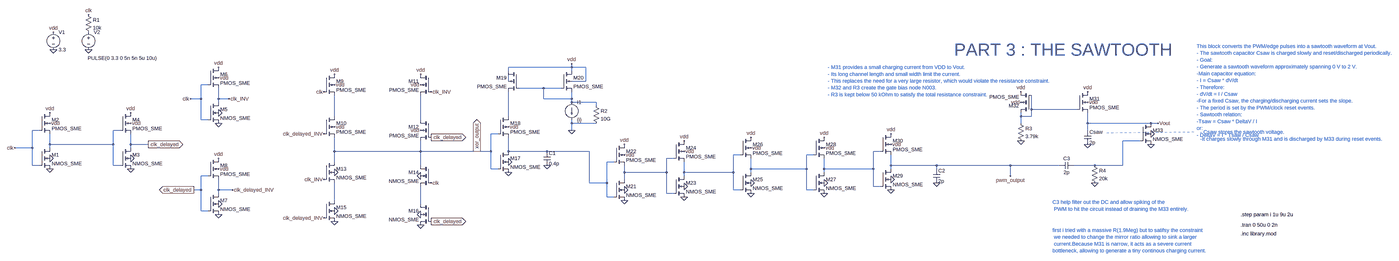
[diagram p0: schematic CMOS_Project_part3.asc, whole sheet]
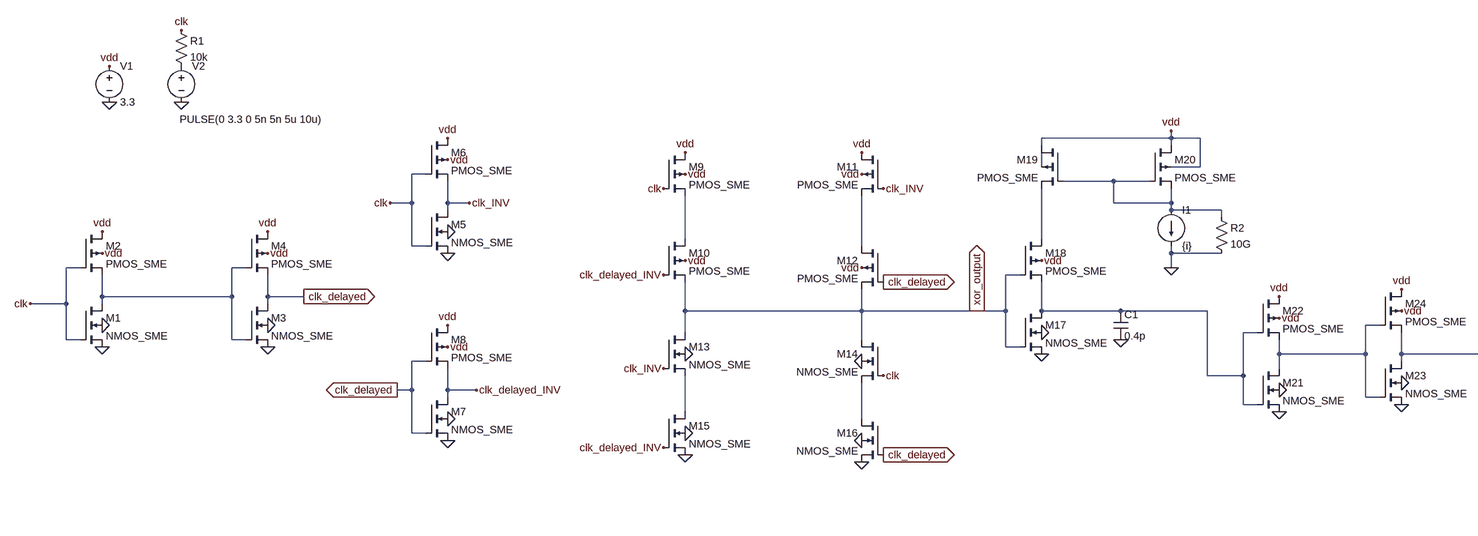
[diagram p1: schematic CMOS_Project_part3.asc, part, row 1 of 1, column 1 of 2]
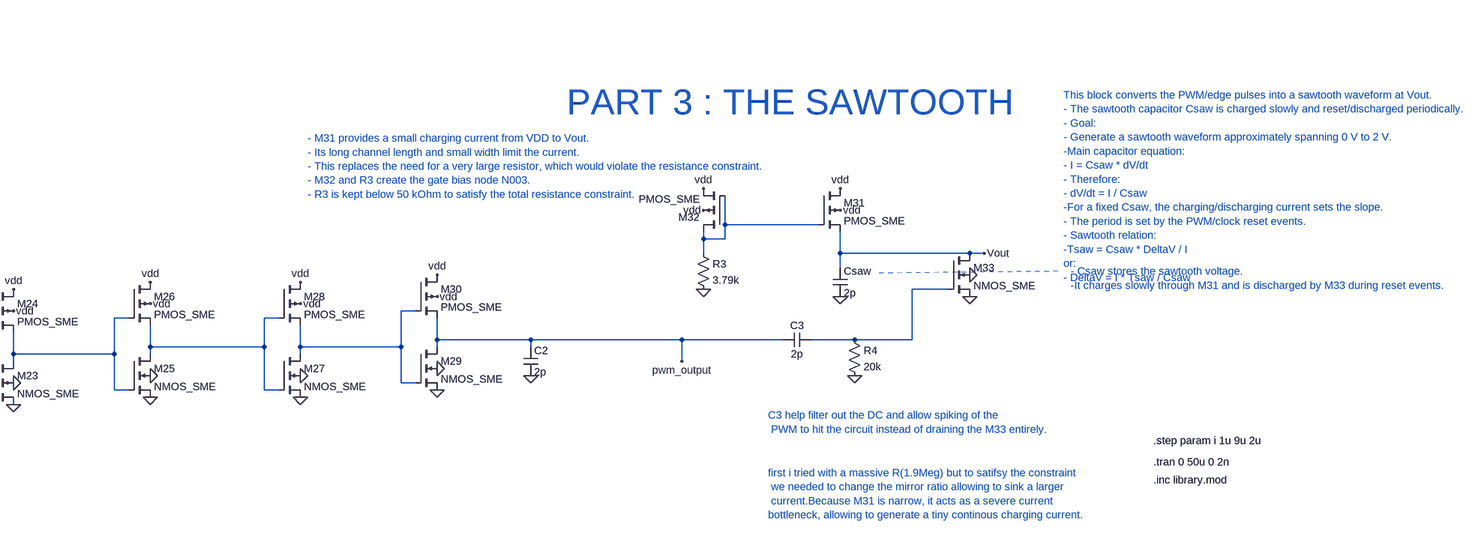
[diagram p2: schematic CMOS_Project_part3.asc, part, row 1 of 1, column 2 of 2]
CMOS_Project_part3.asc, the LTspice schematic file:
Version 4
SHEET 1 7728 1124
WIRE 2688 -128 2688 -144
WIRE 2688 -128 2400 -128
WIRE 2752 -128 2688 -128
WIRE 2400 -112 2400 -128
WIRE 2688 -112 2688 -128
WIRE 2400 -64 2400 -96
WIRE 2752 -64 2752 -128
WIRE 2752 -64 2688 -64
WIRE 960 -48 928 -48
WIRE 2560 -32 2448 -32
WIRE 2640 -32 2560 -32
WIRE 928 16 928 -48
WIRE 928 16 880 16
WIRE 1008 16 1008 -32
WIRE 1056 16 1008 16
WIRE 2560 16 2560 -32
WIRE 2688 16 2688 -16
WIRE 2688 16 2560 16
WIRE 1008 32 1008 16
WIRE 2688 32 2688 16
WIRE 2800 32 2688 32
WIRE 2800 48 2800 32
WIRE 4800 64 4800 0
WIRE 5008 64 4800 64
WIRE 1536 96 1536 0
WIRE 2400 96 2400 -16
WIRE 4752 96 4752 80
WIRE 4800 96 4800 64
WIRE 4800 96 4752 96
WIRE 928 112 928 16
WIRE 960 112 928 112
WIRE 2000 112 2000 0
WIRE 2688 128 2688 112
WIRE 2800 128 2688 128
WIRE 4752 128 4752 96
WIRE 5056 128 5056 80
WIRE 5344 128 5056 128
WIRE 5376 128 5344 128
WIRE 192 160 160 160
WIRE 560 160 528 160
WIRE 2688 160 2688 128
WIRE 5056 160 5056 128
WIRE 2352 176 2320 176
WIRE 5296 208 5216 208
WIRE 240 224 240 176
WIRE 528 224 528 160
WIRE 528 224 240 224
WIRE 608 224 608 176
WIRE 688 224 608 224
WIRE 160 240 160 160
WIRE 160 240 80 240
WIRE 240 240 240 224
WIRE 608 240 608 224
WIRE 1536 256 1536 192
WIRE 2000 256 2000 208
WIRE 2000 256 1536 256
WIRE 2256 256 2000 256
WIRE 2320 256 2320 176
WIRE 2320 256 2256 256
WIRE 2400 256 2400 192
WIRE 2576 256 2400 256
WIRE 2768 256 2576 256
WIRE 4112 256 4080 256
WIRE 3456 272 3424 272
WIRE 3808 272 3776 272
WIRE 3152 288 3120 288
WIRE 1536 304 1536 256
WIRE 2880 304 2848 304
WIRE 160 320 160 240
WIRE 192 320 160 320
WIRE 528 320 528 224
WIRE 560 320 528 320
WIRE 2000 320 2000 256
WIRE 4160 320 4160 272
WIRE 4368 320 4160 320
WIRE 4704 320 4368 320
WIRE 4928 320 4704 320
WIRE 5088 320 4992 320
WIRE 5216 320 5216 208
WIRE 5216 320 5088 320
WIRE 2320 336 2320 256
WIRE 2352 336 2320 336
WIRE 3504 336 3504 288
WIRE 3776 336 3776 272
WIRE 3776 336 3504 336
WIRE 3856 336 3856 288
WIRE 4080 336 4080 256
WIRE 4080 336 3856 336
WIRE 4160 336 4160 320
WIRE 4368 336 4368 320
WIRE 2928 352 2928 320
WIRE 3120 352 3120 288
WIRE 3120 352 2928 352
WIRE 3200 352 3200 304
WIRE 3424 352 3424 272
WIRE 3424 352 3200 352
WIRE 3504 352 3504 336
WIRE 3856 352 3856 336
WIRE 960 368 928 368
WIRE 3200 368 3200 352
WIRE 4704 368 4704 320
WIRE 2928 384 2928 352
WIRE 2768 400 2768 256
WIRE 2848 400 2848 304
WIRE 2848 400 2768 400
WIRE 4080 416 4080 336
WIRE 4112 416 4080 416
WIRE 928 432 928 368
WIRE 928 432 896 432
WIRE 1008 432 1008 384
WIRE 1072 432 1008 432
WIRE 3424 432 3424 352
WIRE 3456 432 3424 432
WIRE 3776 432 3776 336
WIRE 3808 432 3776 432
WIRE 1008 448 1008 432
WIRE 3120 448 3120 352
WIRE 3152 448 3120 448
WIRE 2848 464 2848 400
WIRE 2880 464 2848 464
WIRE 1536 480 1536 400
WIRE 2000 496 2000 416
WIRE 928 528 928 432
WIRE 960 528 928 528
FLAG 416 -208 0
FLAG 240 288 0
FLAG 256 -208 0
FLAG 256 -288 vdd
FLAG 240 128 vdd
FLAG 608 336 0
FLAG 608 288 0
FLAG 608 80 vdd
FLAG 608 128 vdd
FLAG 240 336 0
FLAG 240 80 vdd
FLAG 1008 128 0
FLAG 1008 80 0
FLAG 1008 -128 vdd
FLAG 1008 -80 vdd
FLAG 1008 544 0
FLAG 1008 496 0
FLAG 1008 288 vdd
FLAG 1008 336 vdd
FLAG 1536 -96 vdd
FLAG 1536 -48 vdd
FLAG 1536 144 vdd
FLAG 2000 -96 vdd
FLAG 2000 -48 vdd
FLAG 2000 160 vdd
FLAG 1536 352 0
FLAG 2000 368 0
FLAG 1536 576 0
FLAG 1536 528 0
FLAG 2000 592 0
FLAG 2000 544 0
FLAG 2400 352 0
FLAG 2400 304 0
FLAG 2400 144 vdd
FLAG 2576 320 0
FLAG 2688 160 0
FLAG 2688 -144 vdd
FLAG 2928 480 0
FLAG 2928 432 0
FLAG 2928 224 vdd
FLAG 2928 272 vdd
FLAG 3200 464 0
FLAG 3200 416 0
FLAG 3200 208 vdd
FLAG 3200 256 vdd
FLAG 3504 448 0
FLAG 3504 400 0
FLAG 3504 192 vdd
FLAG 3504 240 vdd
FLAG 4368 400 0
FLAG 3856 448 0
FLAG 3856 400 0
FLAG 3856 192 vdd
FLAG 3856 240 vdd
FLAG 4160 432 0
FLAG 4160 384 0
FLAG 4160 176 vdd
FLAG 4160 224 vdd
FLAG 688 224 clk_delayed
IOPIN 688 224 Out
FLAG 416 -368 clk
FLAG 80 240 clk
FLAG 1072 432 clk_delayed_INV
FLAG 880 16 clk
FLAG 1056 16 clk_INV
FLAG 896 432 clk_delayed
IOPIN 896 432 Out
FLAG 1488 -16 clk
FLAG 2048 400 clk
FLAG 2048 -16 clk_INV
FLAG 1488 176 clk_delayed_INV
FLAG 1488 384 clk_INV
FLAG 1488 560 clk_delayed_INV
FLAG 2048 576 clk_delayed
IOPIN 2048 576 Out
FLAG 2048 192 clk_delayed
IOPIN 2048 192 Out
FLAG 2256 256 xor_output
IOPIN 2256 256 Out
FLAG 5056 -16 vdd
FLAG 5056 32 vdd
FLAG 4752 32 vdd
FLAG 4752 -16 vdd
FLAG 5344 224 0
FLAG 5344 176 0
FLAG 4752 208 0
FLAG 5376 128 Vout
FLAG 5056 224 0
FLAG 5088 400 0
FLAG 4704 368 pwm_output
SYMBOL nmos4 192 240 R0
SYMATTR InstName M1
SYMATTR Value NMOS_SME
SYMATTR Value2 l=3u w=0.4u
SYMBOL pmos4 192 80 R0
SYMATTR InstName M2
SYMATTR Value PMOS_SME
SYMATTR Value2 l=3u w=0.4u
SYMBOL voltage 256 -304 R0
WINDOW 123 0 0 Left 0
WINDOW 39 0 0 Left 0
SYMATTR InstName V1
SYMATTR Value 3.3
SYMBOL voltage 416 -304 R0
WINDOW 123 0 0 Left 0
WINDOW 39 0 0 Left 0
WINDOW 3 -4 134 Left 2
SYMATTR Value PULSE(0 3.3 0 5n 5n 5u 10u)
SYMATTR InstName V2
SYMBOL nmos4 560 240 R0
SYMATTR InstName M3
SYMATTR Value NMOS_SME
SYMATTR Value2 l=3u w=0.4u
SYMBOL pmos4 560 80 R0
SYMATTR InstName M4
SYMATTR Value PMOS_SME
SYMATTR Value2 l=3u w=0.4u
SYMBOL nmos4 960 32 R0
SYMATTR InstName M5
SYMATTR Value NMOS_SME
SYMATTR Value2 l=0.35u w=0.4u
SYMBOL pmos4 960 -128 R0
SYMATTR InstName M6
SYMATTR Value PMOS_SME
SYMATTR Value2 l=0.35u w=0.4u
SYMBOL nmos4 960 448 R0
SYMATTR InstName M7
SYMATTR Value NMOS_SME
SYMATTR Value2 l=0.35u w=0.4u
SYMBOL pmos4 960 288 R0
SYMATTR InstName M8
SYMATTR Value PMOS_SME
SYMATTR Value2 l=0.35u w=0.4u
SYMBOL pmos4 1488 -96 R0
SYMATTR InstName M9
SYMATTR Value PMOS_SME
SYMATTR Value2 l=0.35u w=0.4u
SYMBOL pmos4 1488 96 R0
SYMATTR InstName M10
SYMATTR Value PMOS_SME
SYMATTR Value2 l=0.35u w=0.4u
SYMBOL pmos4 2048 -96 M0
SYMATTR InstName M11
SYMATTR Value PMOS_SME
SYMATTR Value2 l=0.35u w=0.4u
SYMBOL pmos4 2048 112 M0
SYMATTR InstName M12
SYMATTR Value PMOS_SME
SYMATTR Value2 l=0.35u w=0.4u
SYMBOL nmos4 1488 304 R0
SYMATTR InstName M13
SYMATTR Value NMOS_SME
SYMATTR Value2 l=0.35u w=0.4u
SYMBOL nmos4 2048 320 M0
SYMATTR InstName M14
SYMATTR Value NMOS_SME
SYMATTR Value2 l=0.35u w=0.4u
SYMBOL nmos4 1488 480 R0
SYMATTR InstName M15
SYMATTR Value NMOS_SME
SYMATTR Value2 l=0.35u w=0.4u
SYMBOL nmos4 2048 496 M0
SYMATTR InstName M16
SYMATTR Value NMOS_SME
SYMATTR Value2 l=0.35u w=0.4u
SYMBOL nmos4 2352 256 R0
SYMATTR InstName M17
SYMATTR Value NMOS_SME
SYMATTR Value2 l=0.35u w=4u
SYMBOL pmos4 2352 96 R0
SYMATTR InstName M18
SYMATTR Value PMOS_SME
SYMATTR Value2 l=0.35u w=0.4u
SYMBOL cap 2560 256 R0
SYMATTR InstName C1
SYMATTR Value 0.4p
SYMBOL pmos4 2448 -112 M0
SYMATTR InstName M19
SYMATTR Value PMOS_SME
SYMATTR Value2 l=0.35u w=0.4u
SYMBOL pmos4 2640 -112 R0
SYMATTR InstName M20
SYMATTR Value PMOS_SME
SYMATTR Value2 l=0.35u w=2u
SYMBOL current 2688 32 R0
WINDOW 123 0 0 Left 0
WINDOW 39 0 0 Left 0
SYMATTR InstName I1
SYMATTR Value {i}
SYMBOL res 2784 32 R0
SYMATTR InstName R2
SYMATTR Value 10G
SYMBOL nmos4 2880 384 R0
SYMATTR InstName M21
SYMATTR Value NMOS_SME
SYMATTR Value2 l=0.35u w=4u
SYMBOL pmos4 2880 224 R0
SYMATTR InstName M22
SYMATTR Value PMOS_SME
SYMATTR Value2 l=0.35u w=3.5u
SYMBOL nmos4 3152 368 R0
SYMATTR InstName M23
SYMATTR Value NMOS_SME
SYMATTR Value2 l=0.35u w=2u
SYMBOL pmos4 3152 208 R0
SYMATTR InstName M24
SYMATTR Value PMOS_SME
SYMATTR Value2 l=0.35u w=2u
SYMBOL nmos4 3456 352 R0
SYMATTR InstName M25
SYMATTR Value NMOS_SME
SYMATTR Value2 l=0.35u w=4u
SYMBOL pmos4 3456 192 R0
SYMATTR InstName M26
SYMATTR Value PMOS_SME
SYMATTR Value2 l=0.35u w=4u
SYMBOL cap 4352 336 R0
SYMATTR InstName C2
SYMATTR Value 2p
SYMBOL nmos4 3808 352 R0
SYMATTR InstName M27
SYMATTR Value NMOS_SME
SYMATTR Value2 l=0.35u w=5u
SYMBOL pmos4 3808 192 R0
SYMATTR InstName M28
SYMATTR Value PMOS_SME
SYMATTR Value2 l=0.35u w=5u
SYMBOL nmos4 4112 336 R0
SYMATTR InstName M29
SYMATTR Value NMOS_SME
SYMATTR Value2 l=0.35u w=6u
SYMBOL pmos4 4112 176 R0
SYMATTR InstName M30
SYMATTR Value PMOS_SME
SYMATTR Value2 l=0.35u w=6u
SYMBOL Res 400 -384 R0
SYMATTR InstName R1
SYMATTR Value 10k
SYMBOL pmos4 5008 -16 R0
SYMATTR InstName M31
SYMATTR Value PMOS_SME
SYMATTR Value2 l=5u w=0.4u
SYMBOL pmos4 4800 80 R180
SYMATTR InstName M32
SYMATTR Value PMOS_SME
SYMATTR Value2 l=0.35u w=10u
SYMBOL Res 4736 112 R0
SYMATTR InstName R3
SYMATTR Value 3.79k
SYMBOL nmos4 5296 128 R0
SYMATTR InstName M33
SYMATTR Value NMOS_SME
SYMATTR Value2 l=0.35u w=10u
SYMBOL Cap 5040 160 R0
SYMATTR InstName Csaw
SYMATTR Value 2p
SYMBOL Cap 4992 304 R90
WINDOW 0 0 32 VBottom 2
WINDOW 3 32 32 VTop 2
SYMATTR InstName C3
SYMATTR Value 2p
SYMBOL Res 5072 304 R0
SYMATTR InstName R4
SYMATTR Value 20k
TEXT 5752 632 Left 2 !.inc library.mod
TEXT 5752 592 Left 2 !.tran 0 50u 0 2n
TEXT 5752 544 Left 2 !.step param i 1u 9u 2u
TEXT 4448 -208 Left 6 ;PART 3 : THE SAWTOOTH
TEXT 4896 488 Left 2 ;C3 help filter out the DC and allow spiking of the\n PWM to hit the circuit instead of draining the M33 entirely.
TEXT 4896 616 Left 2 ;first i tried with a massive R(1.9Meg) but to satifsy the constraint\n we needed to change the mirror ratio allowing to sink a larger\n current.Because M31 is narrow, it acts as a severe current \nbottleneck, allowing to generate a tiny continous charging current.
TEXT 5552 -224 Left 2 ;This block converts the PWM/edge pulses into a sawtooth waveform at Vout.\n- The sawtooth capacitor Csaw is charged slowly and reset/discharged periodically.\n- Goal:\n- Generate a sawtooth waveform approximately spanning 0 V to 2 V.\n-Main capacitor equation:\n- I = Csaw * dV/dt\n- Therefore:\n- dV/dt = I / Csaw\n-For a fixed Csaw, the charging/discharging current sets the slope.\n- The period is set by the PWM/clock reset events.\n- Sawtooth relation:\n-Tsaw = Csaw * DeltaV / I\nor:\n- DeltaV = I * Tsaw / Csaw
TEXT 3872 -128 Left 2 ;- M31 provides a small charging current from VDD to Vout.\n- Its long channel length and small width limit the current.\n- This replaces the need for a very large resistor, which would violate the resistance constraint.\n- M32 and R3 create the gate bias node N003.\n- R3 is kept below 50 kOhm to satisfy the total resistance constraint.
TEXT 5568 168 Left 2 ;- Csaw stores the sawtooth voltage.\n-It charges slowly through M31 and is discharged by M33 during reset events.
LINE Normal 5540 168 5132 172 2

The netlist it stands for:
* CMOS_Project_part3.asc
M1 N007 clk 0 0 NMOS_SME l=3u w=0.4u
M2 vdd clk N007 vdd PMOS_SME l=3u w=0.4u
V1 vdd 0 3.3
V2 P001 0 PULSE(0 3.3 0 5n 5n 5u 10u)
M3 clk_delayed N007 0 0 NMOS_SME l=3u w=0.4u
M4 vdd N007 clk_delayed vdd PMOS_SME l=3u w=0.4u
M5 clk_INV clk 0 0 NMOS_SME l=0.35u w=0.4u
M6 vdd clk clk_INV vdd PMOS_SME l=0.35u w=0.4u
M7 clk_delayed_INV clk_delayed 0 0 NMOS_SME l=0.35u w=0.4u
M8 vdd clk_delayed clk_delayed_INV vdd PMOS_SME l=0.35u w=0.4u
M9 vdd clk N004 vdd PMOS_SME l=0.35u w=0.4u
M10 N004 clk_delayed_INV xor_output vdd PMOS_SME l=0.35u w=0.4u
M11 vdd clk_INV N006 vdd PMOS_SME l=0.35u w=0.4u
M12 N006 clk_delayed xor_output vdd PMOS_SME l=0.35u w=0.4u
M13 xor_output clk_INV N014 0 NMOS_SME l=0.35u w=0.4u
M14 xor_output clk N015 0 NMOS_SME l=0.35u w=0.4u
M15 N014 clk_delayed_INV 0 0 NMOS_SME l=0.35u w=0.4u
M16 N015 clk_delayed 0 0 NMOS_SME l=0.35u w=0.4u
M17 N009 xor_output 0 0 NMOS_SME l=0.35u w=4u
M18 N005 xor_output N009 vdd PMOS_SME l=0.35u w=0.4u
C1 N009 0 0.4p
M19 vdd N002 N005 N001 PMOS_SME l=0.35u w=0.4u
M20 vdd N002 N002 vdd PMOS_SME l=0.35u w=2u
I1 N002 0 {i}
R2 N002 0 10G
M21 N013 N009 0 0 NMOS_SME l=0.35u w=4u
M22 vdd N009 N013 vdd PMOS_SME l=0.35u w=3.5u
M23 N011 N013 0 0 NMOS_SME l=0.35u w=2u
M24 vdd N013 N011 vdd PMOS_SME l=0.35u w=2u
M25 N012 N011 0 0 NMOS_SME l=0.35u w=4u
M26 vdd N011 N012 vdd PMOS_SME l=0.35u w=4u
C2 pwm_output 0 2p
M27 N010 N012 0 0 NMOS_SME l=0.35u w=5u
M28 vdd N012 N010 vdd PMOS_SME l=0.35u w=5u
M29 pwm_output N010 0 0 NMOS_SME l=0.35u w=6u
M30 vdd N010 pwm_output vdd PMOS_SME l=0.35u w=6u
R1 clk P001 10k
M31 vdd N003 Vout vdd PMOS_SME l=5u w=0.4u
M32 N003 N003 vdd vdd PMOS_SME l=0.35u w=10u
R3 N003 0 3.79k
M33 Vout N008 0 0 NMOS_SME l=0.35u w=10u
Csaw Vout 0 2p
C3 N008 pwm_output 2p
R4 N008 0 20k
.model NMOS NMOS
.model PMOS PMOS
.lib standard.mos
.inc library.mod
.tran 0 50u 0 2n
.step param i 1u 9u 2u
* PART 3 : THE SAWTOOTH
* C3 help filter out the DC and allow spiking of the
*  PWM to hit the circuit instead of draining the M33 entirely.
* first i tried with a massive R(1.9Meg) but to satifsy the constraint
*  we needed to change the mirror ratio allowing to sink a larger
*  current.Because M31 is narrow, it acts as a severe current
* bottleneck, allowing to generate a tiny continous charging current.
* This block converts the PWM/edge pulses into a sawtooth waveform at Vout.
* - The sawtooth capacitor Csaw is charged slowly and reset/discharged periodically.
* - Goal:
* - Generate a sawtooth waveform approximately spanning 0 V to 2 V.
* -Main capacitor equation:
* - I = Csaw * dV/dt
* - Therefore:
* - dV/dt = I / Csaw
* -For a fixed Csaw, the charging/discharging current sets the slope.
* - The period is set by the PWM/clock reset events.
* - Sawtooth relation:
* -Tsaw = Csaw * DeltaV / I
* or:
* - DeltaV = I * Tsaw / Csaw
* - M31 provides a small charging current from VDD to Vout.
* - Its long channel length and small width limit the current.
* - This replaces the need for a very large resistor, which would violate the resistance constraint.
* - M32 and R3 create the gate bias node N003.
* - R3 is kept below 50 kOhm to satisfy the total resistance constraint.
* - Csaw stores the sawtooth voltage.
* -It charges slowly through M31 and is discharged by M33 during reset events.
.backanno
.end